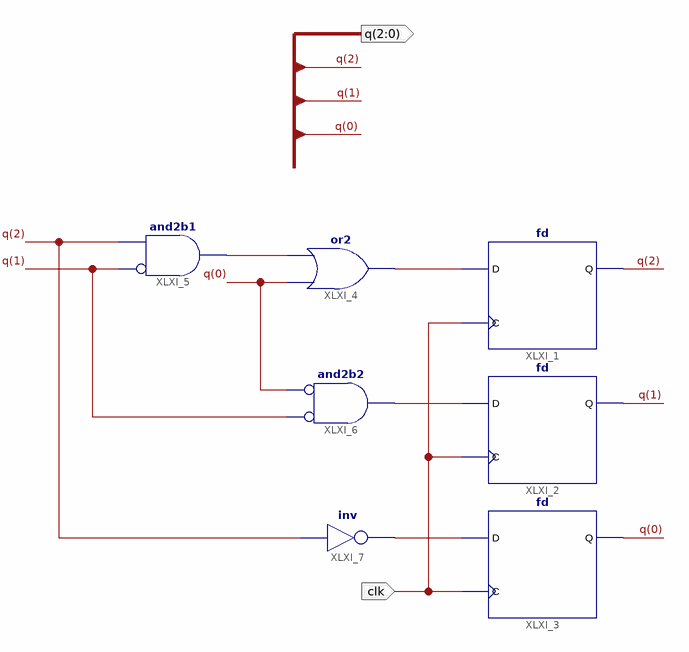
[diagram p0: schematic sheet 1]
// Xilinx ISE schematic special_counter.sch (xc9500) as structural Verilog: 7 symbols, 2 ports
module special_counter (
  input  clk,
  output [2:0] q
);

  wire XLXN_1, XLXN_2, XLXN_7, XLXN_8;

  fd XLXI_1 (.C(clk), .D(XLXN_1), .Q(q[2]));
  fd XLXI_2 (.C(clk), .D(XLXN_7), .Q(q[1]));
  fd XLXI_3 (.C(clk), .D(XLXN_8), .Q(q[0]));
  or XLXI_4 (XLXN_1, q[0], XLXN_2);
  and XLXI_5 (XLXN_2, ~q[1], q[2]);  // and2b1
  and XLXI_6 (XLXN_7, ~q[1], ~q[0]);  // and2b2
  not XLXI_7 (XLXN_8, q[2]);
endmodule
